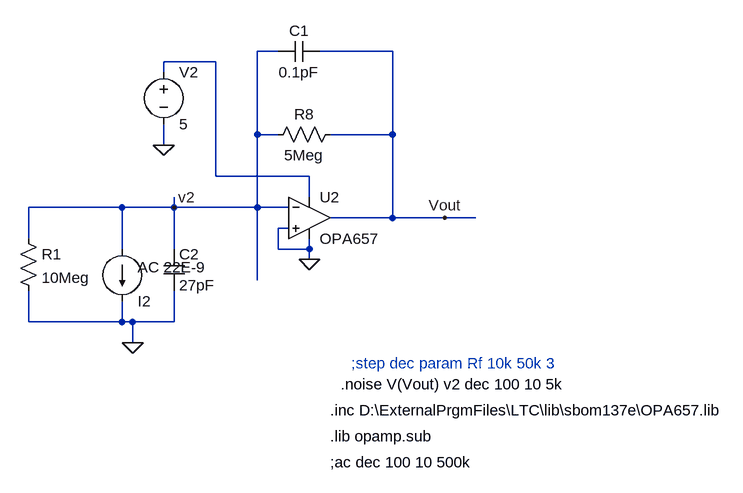
[diagram p0: schematic Tia-rf-study-5M-opa.asc]
Tia-rf-study-5M-opa.asc, the LTspice schematic file:
Version 4
SHEET 1 2888 744
WIRE 2048 -128 2016 -128
WIRE 2224 -128 2112 -128
WIRE 1952 -112 1872 -112
WIRE 1872 -96 1872 -112
WIRE 2016 0 2016 -128
WIRE 2048 0 2016 0
WIRE 2224 0 2224 -128
WIRE 2224 0 2128 0
WIRE 1872 16 1872 -16
WIRE 1952 64 1952 -112
WIRE 2096 64 1952 64
WIRE 2096 96 2096 64
WIRE 1808 112 1664 112
WIRE 1888 112 1888 96
WIRE 1888 112 1808 112
WIRE 2016 112 2016 0
WIRE 2016 112 1888 112
WIRE 2064 112 2016 112
WIRE 2224 128 2224 0
WIRE 2224 128 2128 128
WIRE 2304 128 2224 128
WIRE 2352 128 2304 128
WIRE 2064 144 2048 144
WIRE 1664 160 1664 112
WIRE 1808 176 1808 112
WIRE 1888 176 1888 112
WIRE 2048 176 2048 144
WIRE 2096 176 2096 160
WIRE 2096 176 2048 176
WIRE 2096 192 2096 176
WIRE 2016 224 2016 112
WIRE 1664 288 1664 240
WIRE 1808 288 1808 256
WIRE 1808 288 1664 288
WIRE 1824 288 1808 288
WIRE 1888 288 1888 240
WIRE 1888 288 1824 288
WIRE 1824 320 1824 288
FLAG 1824 320 0
FLAG 1872 16 0
FLAG 2096 192 0
FLAG 1888 112 v2
FLAG 2304 128 Vout
SYMBOL cap 1872 176 R0
SYMATTR InstName C2
SYMATTR Value 27pF
SYMBOL voltage 1872 -112 R0
WINDOW 123 0 0 Left 2
WINDOW 39 0 0 Left 2
SYMATTR InstName V2
SYMATTR Value 5
SYMBOL res 2144 -16 R90
WINDOW 0 0 56 VBottom 2
WINDOW 3 32 56 VTop 2
SYMATTR InstName R8
SYMATTR Value 5Meg
SYMBOL Opamps\\UniversalOpamp2 2096 128 R0
SYMATTR InstName U2
SYMATTR SpiceModel ""
SYMATTR Value2 ""
SYMATTR SpiceLine ""
SYMATTR SpiceLine2 ""
SYMATTR Value OPA657
SYMBOL current 1808 176 R0
WINDOW 0 24 80 Left 2
WINDOW 3 24 0 Left 2
WINDOW 123 24 28 Left 2
WINDOW 39 0 0 Left 2
SYMATTR InstName I2
SYMATTR Value ""
SYMATTR Value2 AC 22E-9
SYMBOL cap 2112 -144 R90
WINDOW 0 0 32 VBottom 2
WINDOW 3 32 32 VTop 2
SYMATTR InstName C1
SYMATTR Value 0.1pF
SYMBOL res 1648 144 R0
SYMATTR InstName R1
SYMATTR Value 10Meg
TEXT 2128 504 Left 2 !;ac dec 100 10 500k
TEXT 2128 424 Left 2 !.inc D:\\ExternalPrgmFiles\\LTC\\lib\\sbom137e\\OPA657.lib
TEXT 2128 464 Left 2 !.lib opamp.sub
TEXT 2144 384 Left 2 !.noise V(Vout) v2 dec 100 10 5k
TEXT 2160 352 Left 2 ;;step dec param Rf 10k 50k 3

The netlist it stands for:
* Tia-rf-study-5M-opa.asc
C2 v2 0 27pF
V2 N001 0 5
R8 Vout v2 5Meg
XU2 0 v2 N001 0 Vout OPA657  ; pins IN+ IN- V+ V- OUT
I2 v2 0 AC 22E-9
C1 Vout v2 0.1pF
R1 v2 0 10Meg
;ac dec 100 10 500k
.inc D:\ExternalPrgmFiles\LTC\lib\sbom137e\OPA657.lib
.lib opamp.sub
.noise V(Vout) v2 dec 100 10 5k
* ;step dec param Rf 10k 50k 3
.lib UniversalOpamps2.sub
.backanno
.end